# Altium project ET4207_ANDROID.PrjPcb
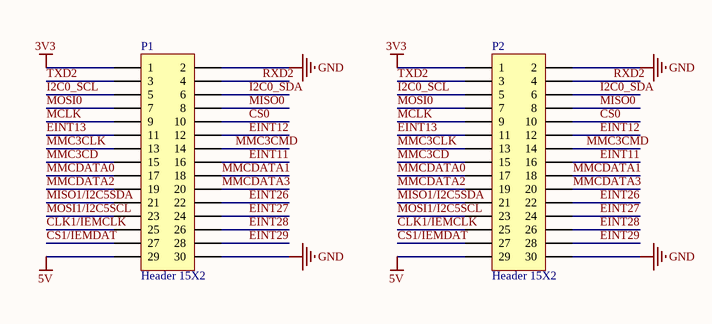
[diagram p0: ET4207_ANDROID.SchDoc]
1 sheet, 2 parts. Net scope: global (net labels, ports and power ports of the same name join across sheets).
Board file: ET4207_ANDROID.PcbDoc

## Sheet ET4207_ANDROID.SchDoc
size 350 x 250 mm

### Parts
P1  Header 15X2  [HDR2X15]
P2  Header 15X2  [DIP30-2.0]

### Nets
3V3: P1.1 P2.1
5V: P1.29 P2.29
GND: P1.2 P1.30 P2.2 P2.30
CLK1/IEMCLK: P1.25 P2.25
CS0: P1.10 P2.10
CS1/IEMDAT: P1.27 P2.27
EINT11: P1.16 P2.16
EINT12: P1.12 P2.12
EINT13: P1.11 P2.11
EINT26: P1.22 P2.22
EINT27: P1.24 P2.24
EINT28: P1.26 P2.26
EINT29: P1.28 P2.28
I2C0_SCL: P1.5 P2.5
I2C0_SDA: P1.6 P2.6
MCLK: P1.9 P2.9
MISO0: P1.8 P2.8
MISO1/I2C5SDA: P1.21 P2.21
MMC3CD: P1.15 P2.15
MMC3CLK: P1.13 P2.13
MMC3CMD: P1.14 P2.14
MMCDATA0: P1.17 P2.17
MMCDATA1: P1.18 P2.18
MMCDATA2: P1.19 P2.19
MMCDATA3: P1.20 P2.20
MOSI0: P1.7 P2.7
MOSI1/I2C5SCL: P1.23 P2.23
RXD2: P1.4 P2.4
TXD2: P1.3 P2.3

### Library data of the parts
P1 P2 = Header 15X2: Header, 15-Pin, Dual row; LatestRevisionDate: 17-Jul-2002; LatestRevisionNote: Re-released for DXP Platform.; Publisher: Altium Limited